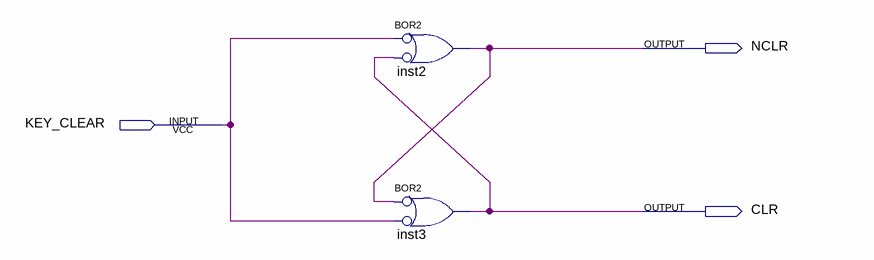
[diagram p0: schematic sheet]
// Quartus schematic RST.bdf as structural Verilog: 2 symbols, 3 pins
module RST (
  input  KEY_CLEAR,
  output NCLR,
  output CLR
);

  or inst2 (NCLR, ~KEY_CLEAR, ~CLR);  // BOR2
  or inst3 (CLR, ~NCLR, ~KEY_CLEAR);  // BOR2
endmodule
